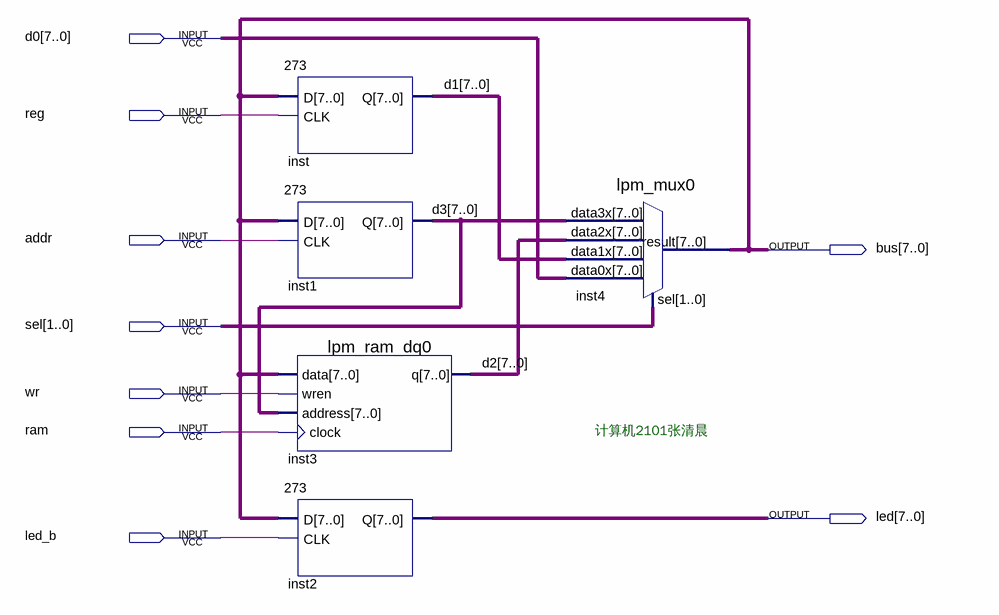
[diagram p0: schematic sheet]
// Quartus schematic BUS.bdf as structural Verilog: 5 symbols, 9 pins
module BUS (
  input  [7:0] d0,
  input  \reg ,
  input  addr,
  input  [1:0] sel,
  input  wr,
  input  ram,
  input  led_b,
  output [7:0] bus,
  output [7:0] led
);

  wire [7:0] d1, d2, d3;

  \273  inst (.D(bus), .CLK(\reg ), .Q(d1));
  \273  inst1 (.D(bus), .CLK(addr), .Q(d3));
  lpm_ram_dq0 inst3 (.data(bus), .wren(wr), .address(d3), .clock(ram), .q(d2));
  \273  inst2 (.D(bus), .CLK(led_b), .Q(led));
  lpm_mux0 inst4 (.data3x(d3), .data2x(d2), .data1x(d1), .data0x(d0), .sel(sel), .result(bus));

  // Notes on the sheet:
  //   计算机2101张清晨
endmodule
